# EasyEDA Pro project 四轮车板子.epro, schematic Schematic2

## Sheets
1 Power: Create Date: 2023-06-30; Page Name: Power; Project Name: 国光_无敌车; Schematic Name: Schematic2; Update Date: 2023-06-30; Add into BOM: yes; Convert to PCB: yes
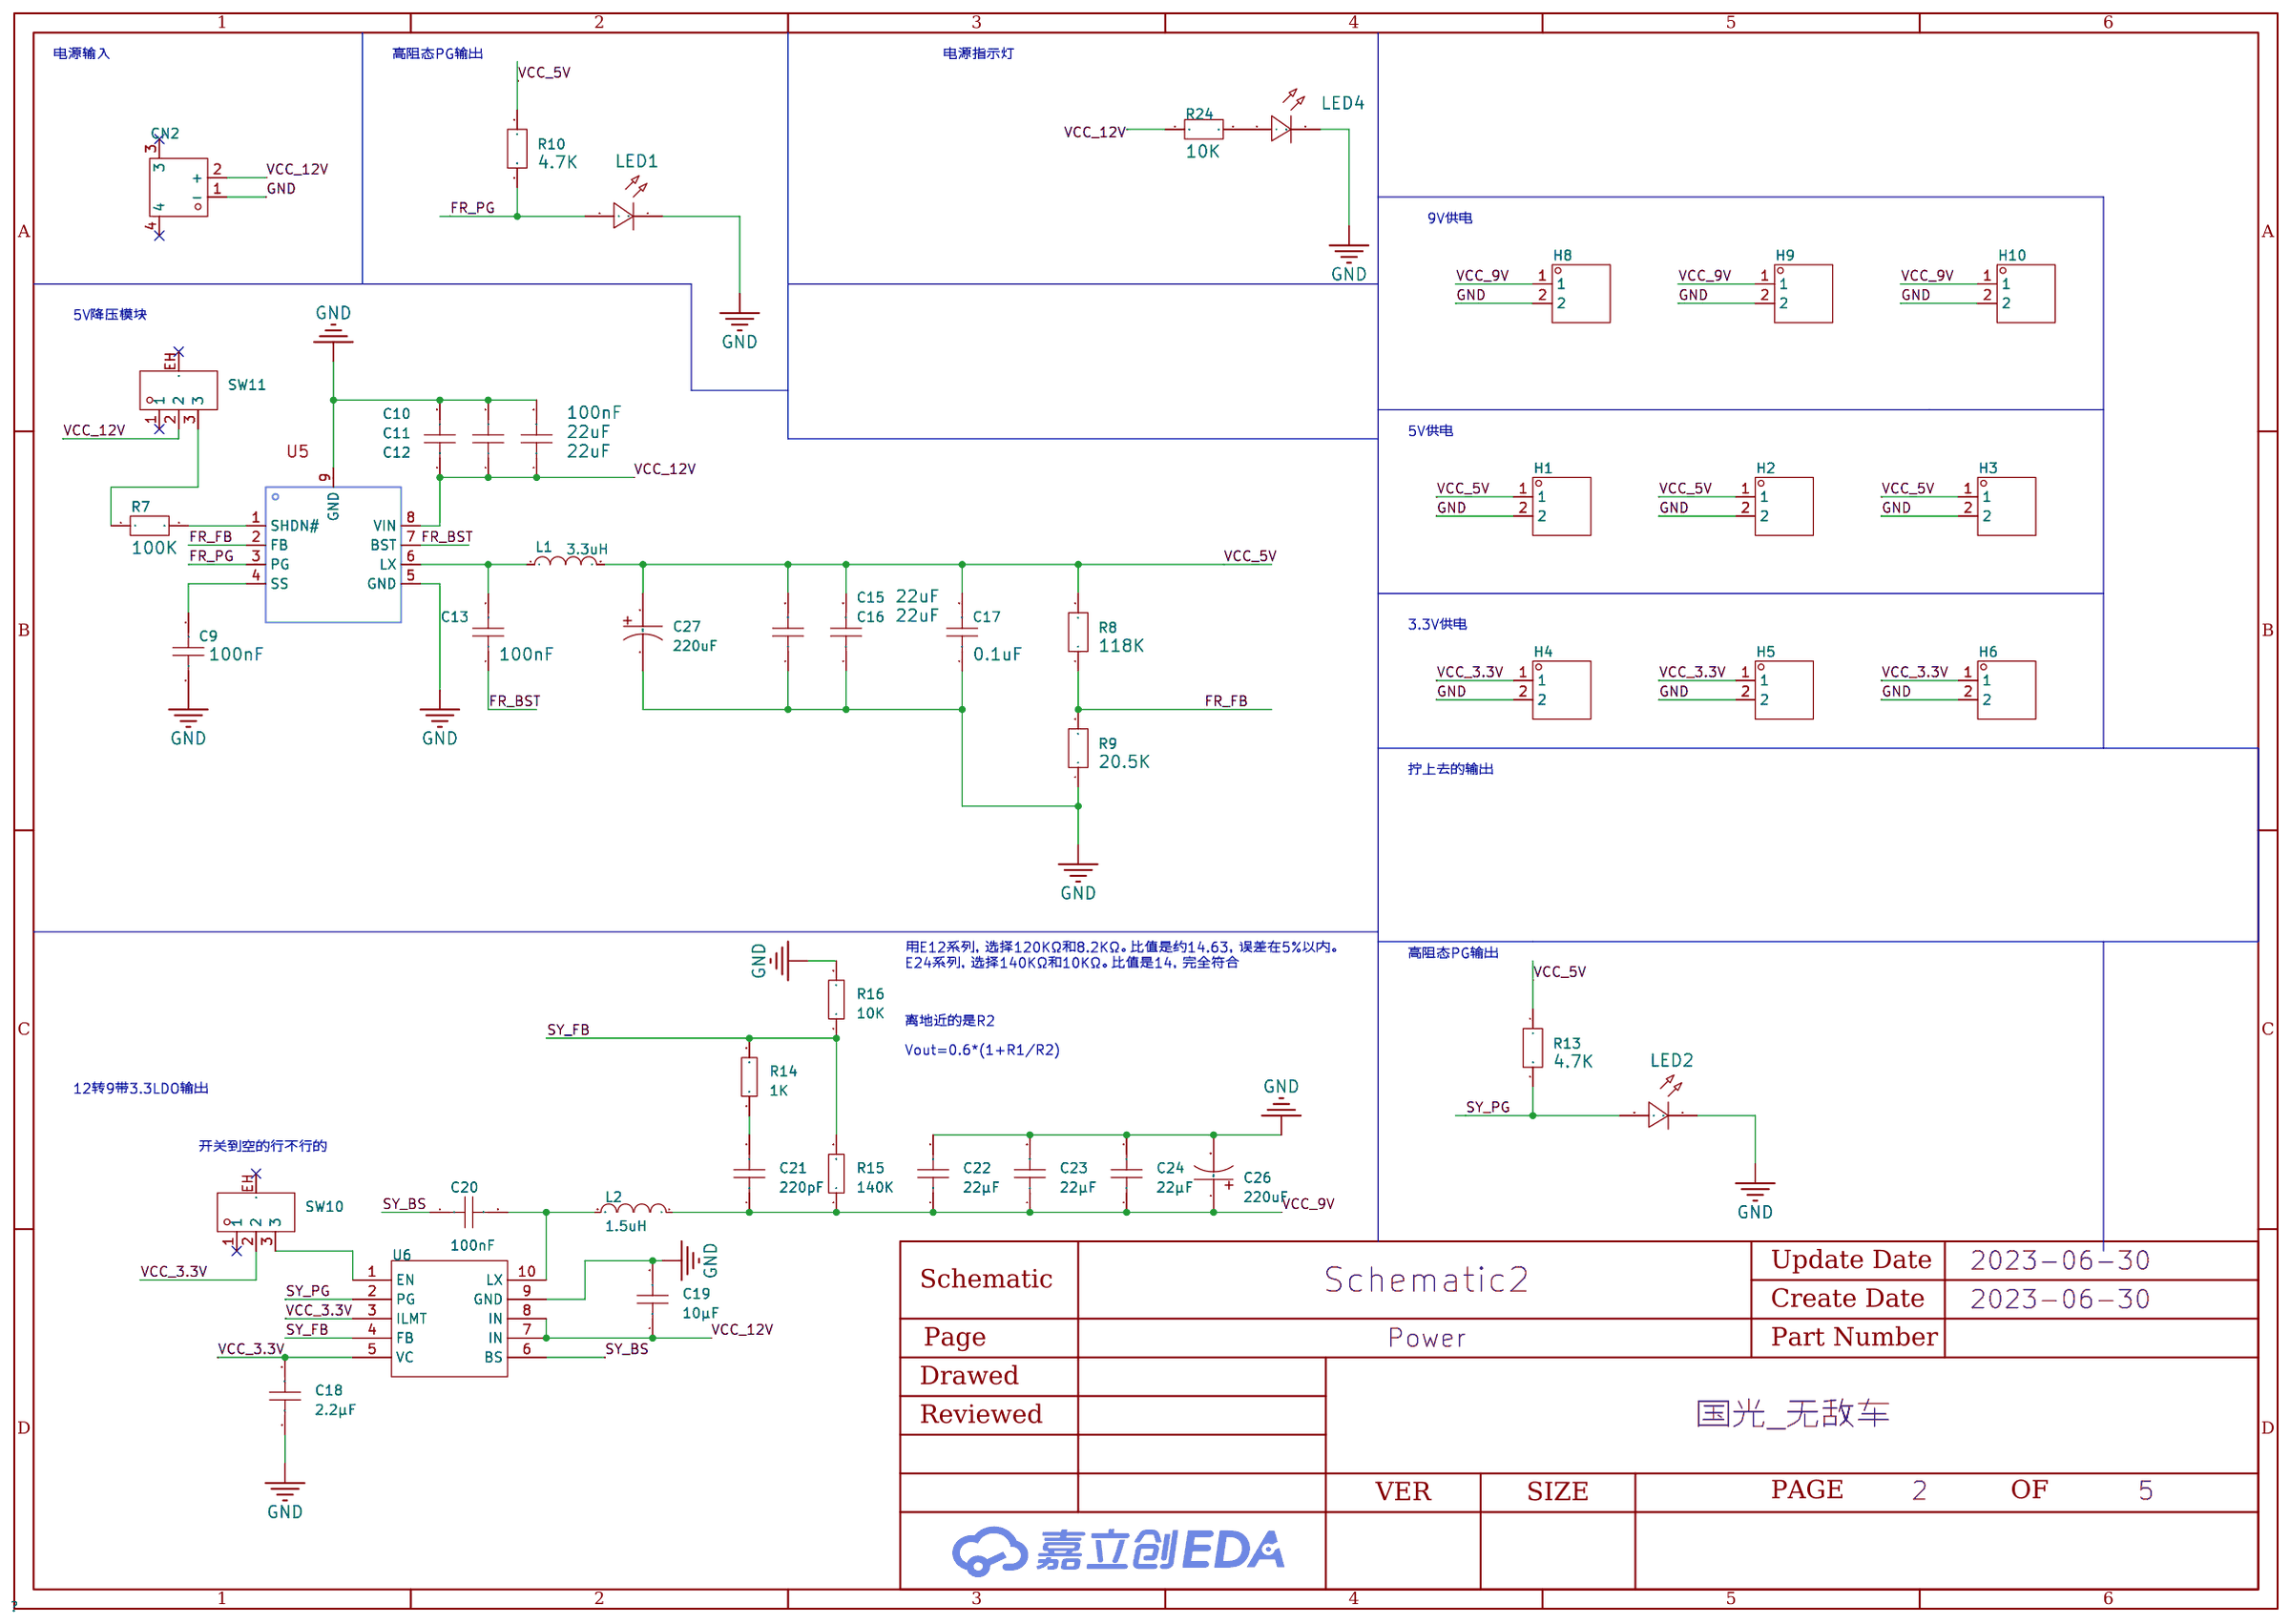
[diagram p6: Power]
2 raspberry: Page Name: raspberry; Update Date: 2023-07-02; Company: 嘉立创EDA; Page Size: A4; Version: V1.0
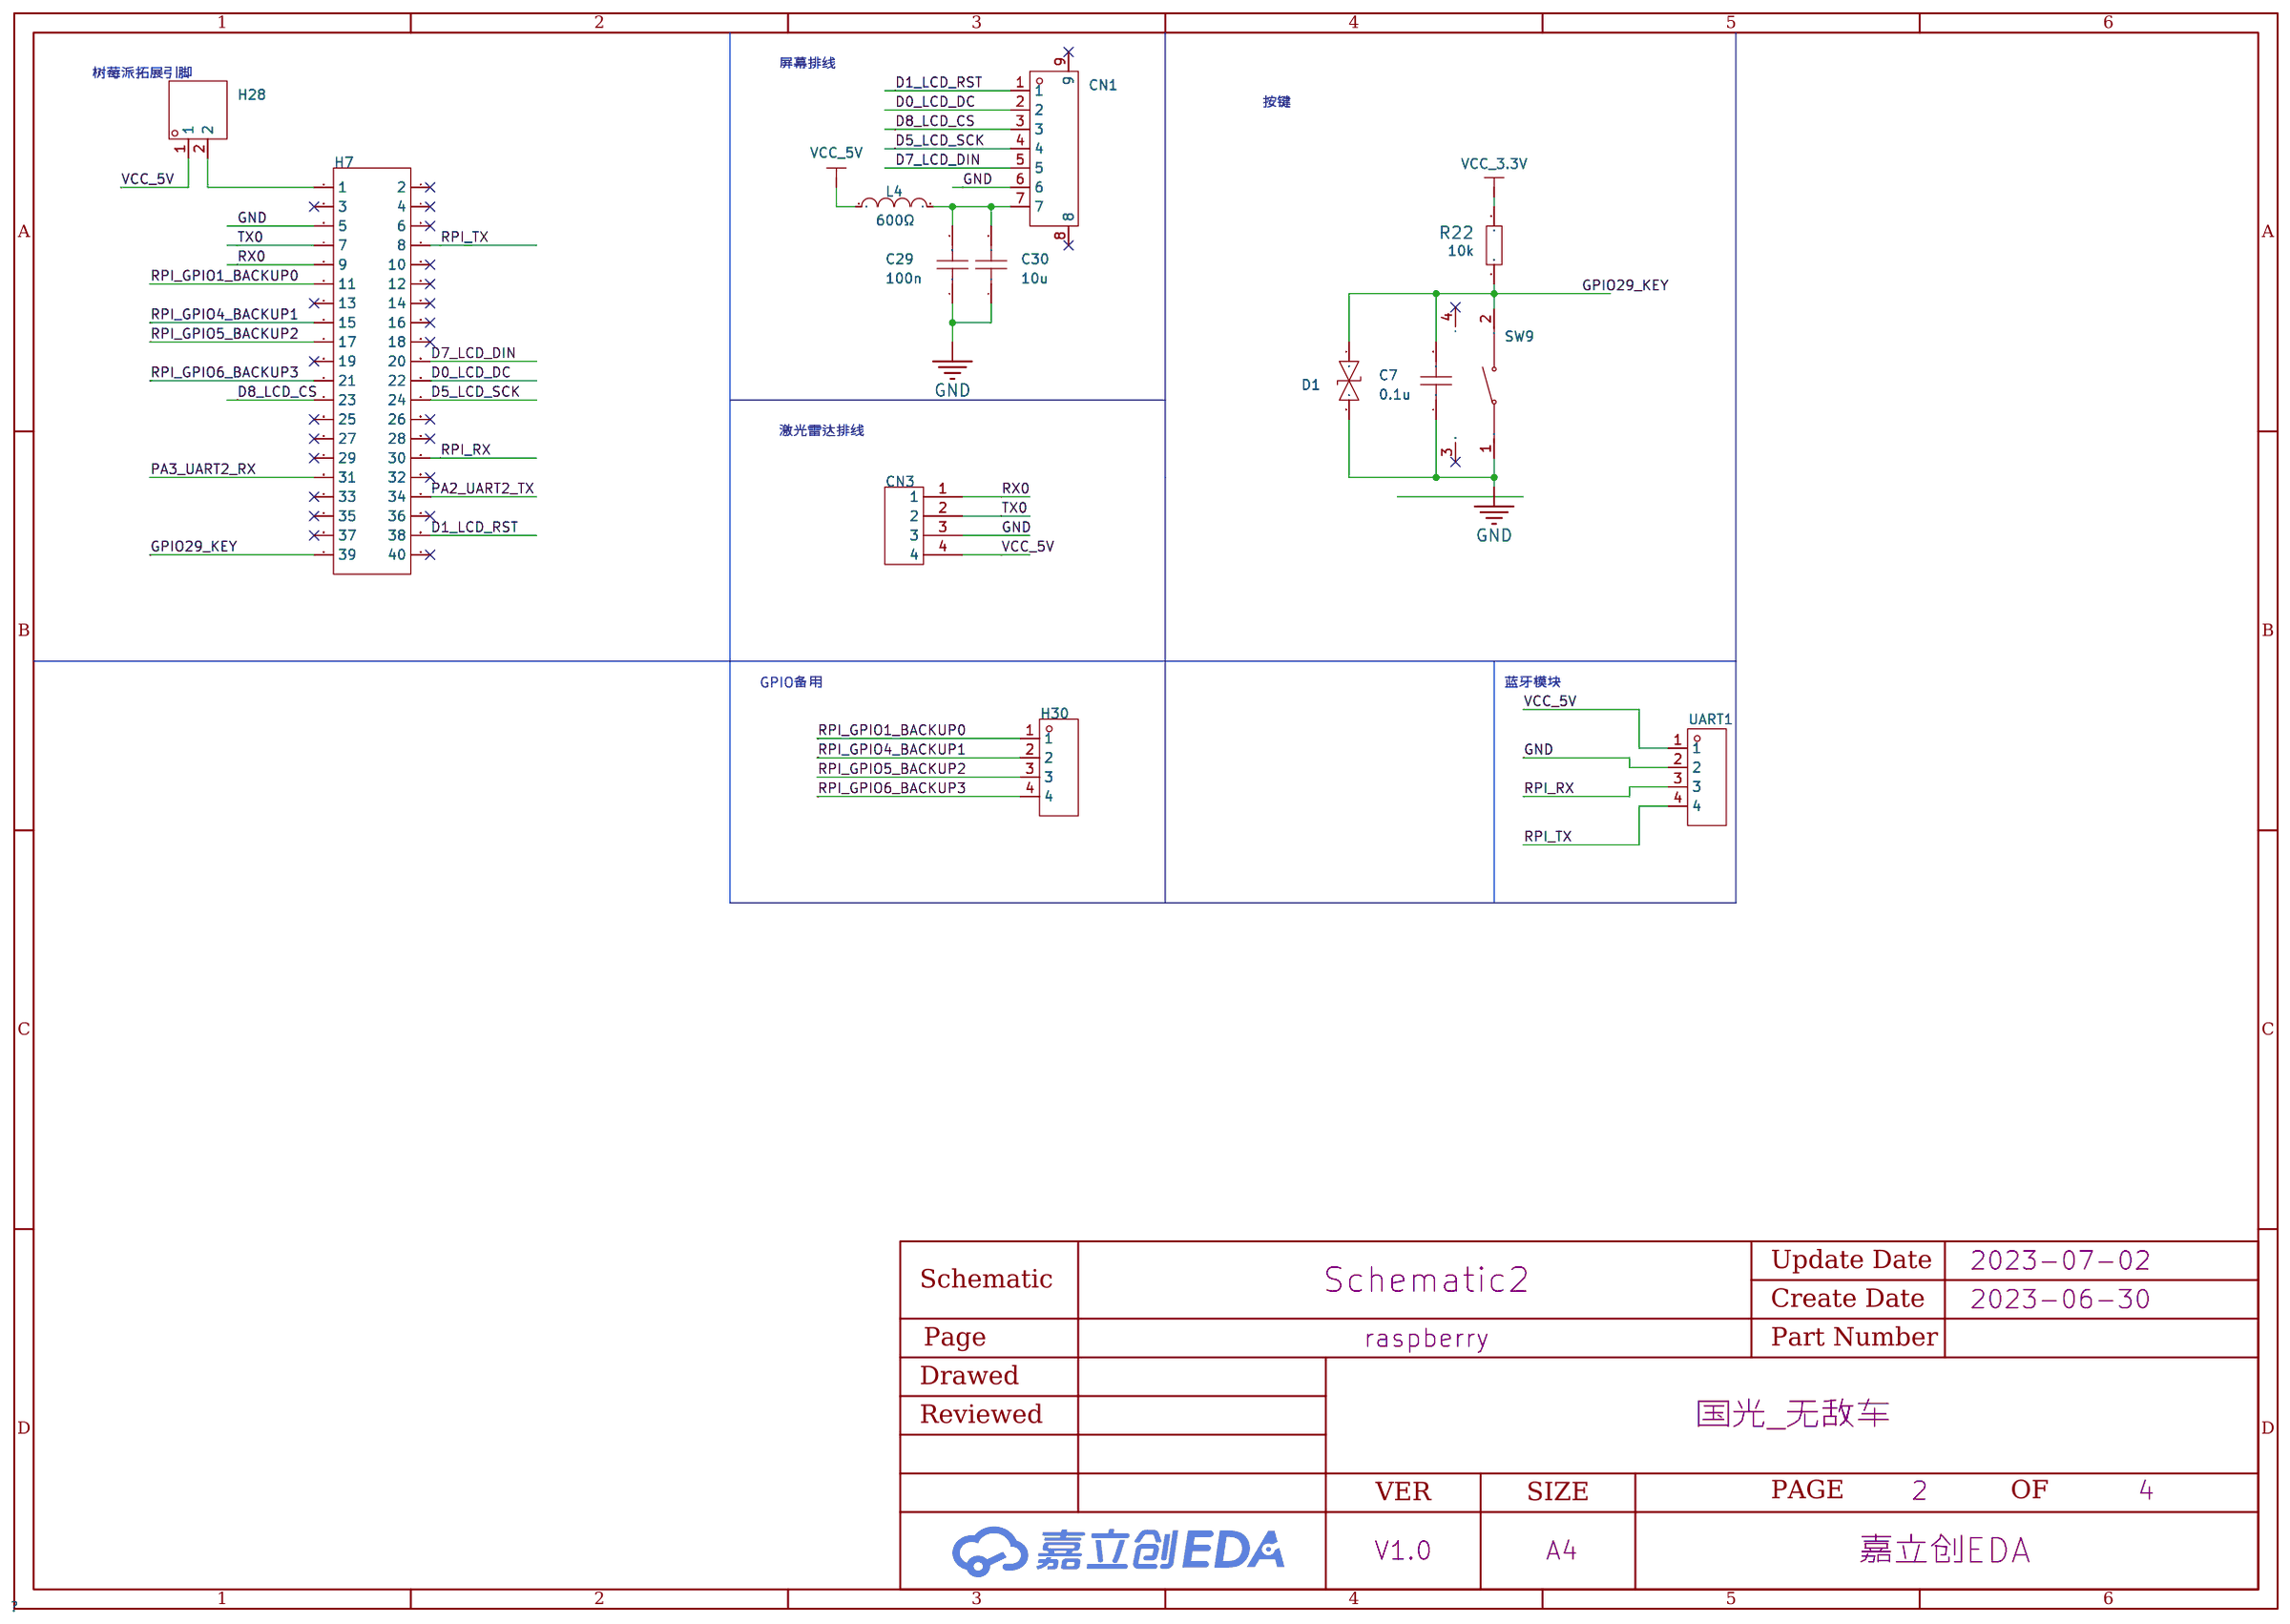
[diagram p7: raspberry]
3 harddrive: Page Name: harddrive; Update Date: 2023-07-02; Company: 嘉立创EDA; Page Size: A4; Version: V1.0
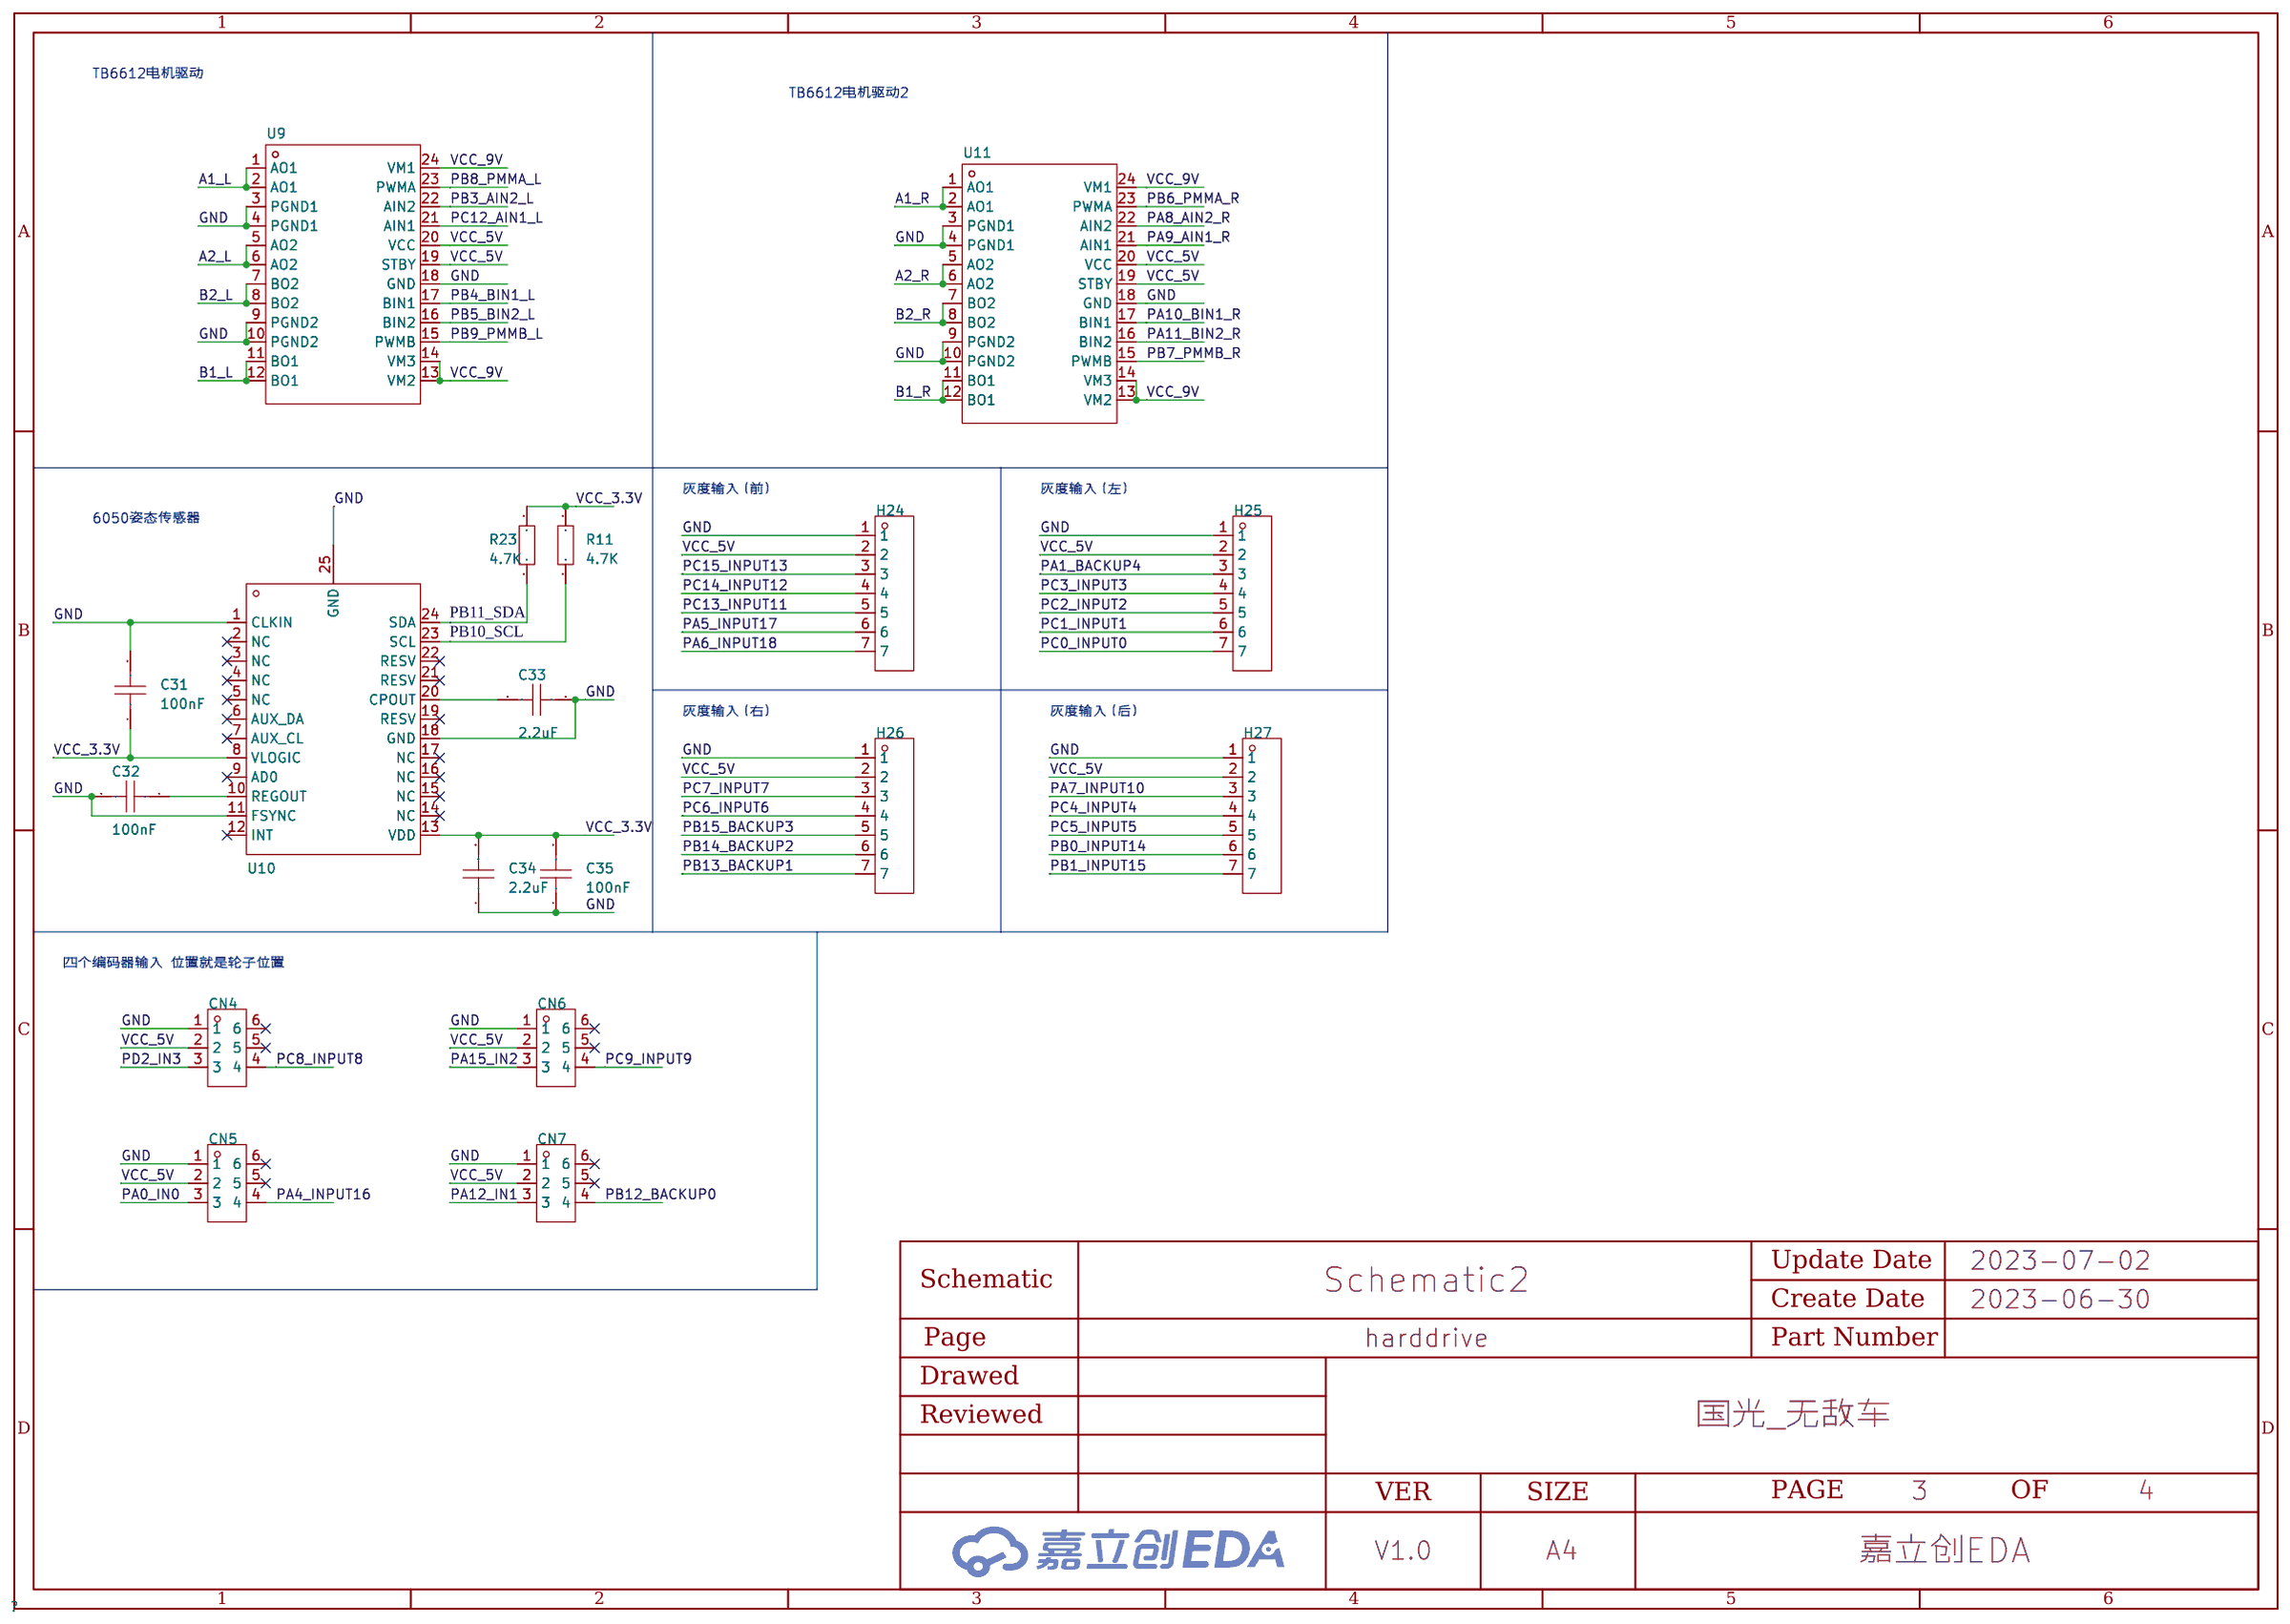
[diagram p8: harddrive]
4 RCT6: Create Date: 2023-07-02; Page Name: RCT6; Update Date: 2023-07-02; Company: 嘉立创EDA; Page Size: A4; Version: V1.0
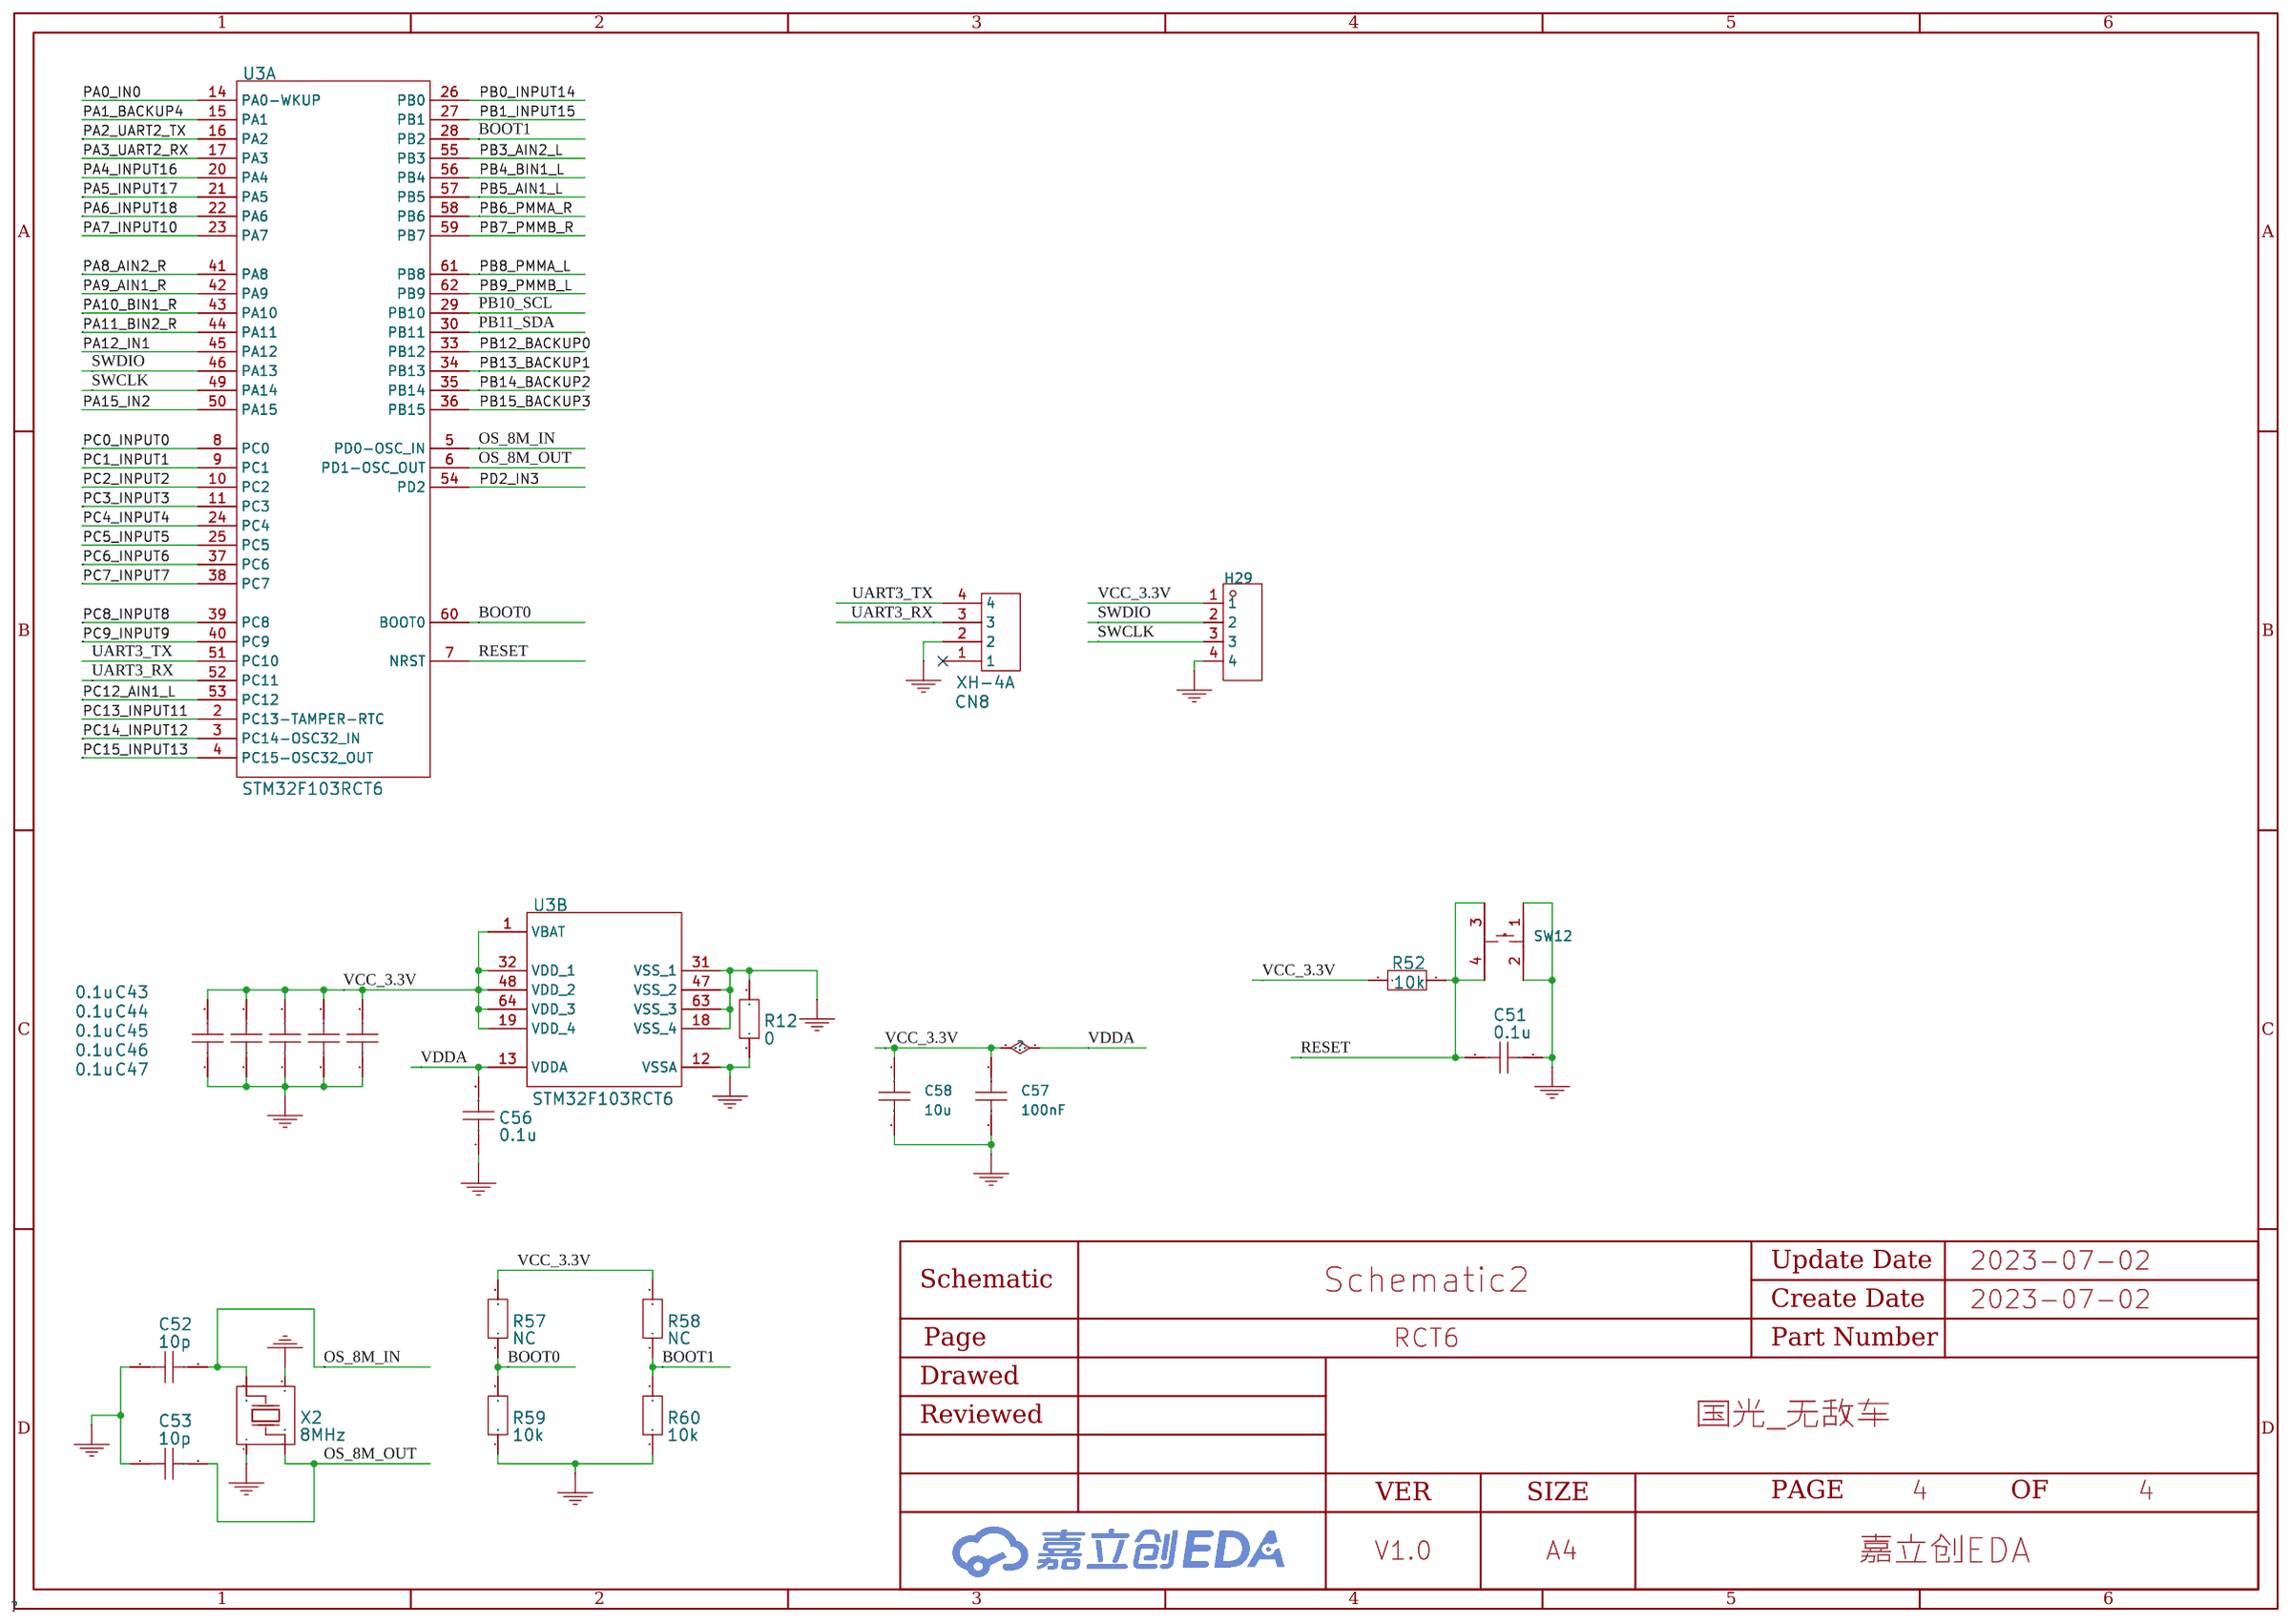
[diagram p9: RCT6]

## Parts
sheet harddrive
C31  100nF  [C0603]
C32  100nF  [C0603]
C33  2.2uF  [C0603]
C34  2.2uF  [C0603]
C35  100nF  [C0603]
CN4  BH254V-6P  [IDC-TH_6P-P2.54-V-R2-C3-S2.54]
CN5  BH254V-6P  [IDC-TH_6P-P2.54-V-R2-C3-S2.54]
CN6  BH254V-6P  [IDC-TH_6P-P2.54-V-R2-C3-S2.54]
CN7  BH254V-6P  [IDC-TH_6P-P2.54-V-R2-C3-S2.54]
H24  -  [HDR-TH_7P-P2.54-V-M]
H25  -  [HDR-TH_7P-P2.54-V-M]
H26  -  [HDR-TH_7P-P2.54-V-M]
H27  -  [HDR-TH_7P-P2.54-V-M]
R11  4.7K  [R0603]
R23  4.7K  [R0603]
U9  TB6612FNG,C,8,EL  [SSOP-24_L8.3-W5.6-P0.65-LS7.6-BL]
U10  MPU-6050  [QFN-24_L4.0-W4.0-P0.50-BL-EP2.7]
U11  TB6612FNG,C,8,EL  [SSOP-24_L8.3-W5.6-P0.65-LS7.6-BL]
sheet Power
C9  100nF  [C0603]
C10  22uF  [C0603]
C11  22uF  [C0603]
C12  100nF  [C0603]
C13  100nF  [C0603]
C15  22uF  [C0603]
C16  22uF  [C0603]
C17  0.1uF  [C0603]
C18  2.2μF  [C0603]
C19  10μF  [C0603]
C20  100nF  [C0603]
C21  220pF  [C0603]
C22  22μF  [C0603]
C23  22μF  [C0603]
C24  22μF  [C0603]
C26  220uF  [CAP-TH_BD8.0-P3.50-D0.6-FD]
C27  220uF  [CAP-TH_BD8.0-P3.50-D0.6-FD]
CN2  XT60PW-M  [CONN-TH_XT60PW-M]
H1  -  [HDR-TH_2P-P2.54-V-M-1]
H2  -  [HDR-TH_2P-P2.54-V-M-1]
H3  -  [HDR-TH_2P-P2.54-V-M-1]
H4  -  [HDR-TH_2P-P2.54-V-M-1]
H5  -  [HDR-TH_2P-P2.54-V-M-1]
H6  -  [HDR-TH_2P-P2.54-V-M-1]
H8  -  [HDR-TH_2P-P2.54-V-M-1]
H9  -  [HDR-TH_2P-P2.54-V-M-1]
H10  -  [HDR-TH_2P-P2.54-V-M-1]
L1  3.3uH  [IND-SMD_L7.0-W6.6]
L2  1.5uH  [IND-SMD_L13.2-W12.9]
LED1  -  [LED_0603]
LED2  -  [LED_0603]
LED4  -  [LED_0603]
R7  100K  [R0603]
R8  118K  [R0603]
R9  20.5K  [R0603]
R10  4.7K  [R0603]
R13  4.7K  [R0603]
R14  1K  [R0603]
R15  140K  [R0603]
R16  10K  [R0603]
R24  10K  [R0603]
SW10  SS12D07L3B  [SW-TH_SS-12D07-X-X]
SW11  SS12D07L3B  [SW-TH_SS-12D07-X-X]
U5  FR9855SP  [SOIC-8_L4.9-W3.9-P1.27-LS6.0-BL-EP3.3]
U6  SY8368QNC  [QFN-10_L3.0-W3.0-P0.45-TL_SILERGY]
sheet raspberry
C7  0.1u  [C0603]
C29  100n  [C0603]
C30  10u  [C0603]
CN1  X8821WRS-07-9TSN  [CONN-SMD_X8821WRS-07-9TSN]
CN3  XH-4A  [CONN-TH_4P-P2.50_XH-4A]
D1  SD03C  [SOD-323_L1.8-W1.3-LS2.5-BI]
H7  2.54mm2*20P直排针  [HDR-TH_40P-P2.54-V-M-R2-C20-S2.54]
H28  -  [HDR-TH_2P-P2.54-V-M-1]
H30  -  [HDR-TH_4P-P2.54-V-M]
L4  600Ω  [L0603]
R22  10k  [R0603]
SW9  KAN0637-0701B  [SW-TH_KAN0637-0701B]
UART1  -  [HDR-TH_4P-P2.54-V-F]
sheet RCT6
C43  0.1u  [C0603]
C44  0.1u  [C0603]
C45  0.1u  [C0603]
C46  0.1u  [C0603]
C47  0.1u  [C0603]
C51  0.1u  [C0603]
C52  10p  [C0603]
C53  10p  [C0603]
C56  0.1u  [C0603]
C57  100nF  [C0603]
C58  10u  [C0603]
CN8  XH-4A  [CONN-TH_4P-P2.50_XH-4A]
H29  -  [HDR-TH_4P-P2.54-V-M]
R12  0  [R0603]
R52  10k  [R0603]
R57  NC  [R0603]
R58  NC  [R0603]
R59  10k  [R0603]
R60  10k  [R0603]
SW12  -  [SW-SMD_4P-L4.2-W3.4-P2.15-LS4.5-TL]
U3  STM32F103RCT6  [LQFP-64_L10.0-W10.0-P0.50-LS12.0-BL]  (sections 1,2)
X2  8MHz  [OSC-SMD_4P-L3.2-W2.5-BL]

## Library data of the parts
C7 C18-C24 C29-C35 C57 C58 = CAP_0603: Supplier Footprint: 0603
CN4-CN7 = BH254V-6P: 连接器类型:简牛座;每排PIN数:3;排数:2;间距:2.54mm;行距:2.54mm;封装形式:直插;额定电流:3A;额定电压:250V;工作温度范围:-40℃~+105℃;; LCSC Part Name: 每排P数:3 排数:2 2.54mm; Supplier Part: C492441; Manufacturer: XFCN(兴飞); Supplier Footprint: 插件,P=2.54mm; JLCPCB Part Class: Extended Part; Datasheet: https://atta.szlcsc.com/upload/public/pdf/source/20200312/C492441_A0C73C694DE4BA8B104DAD845E0E2036.pdf; Supplier: LCSC; Connector Type: 简牛座; Pin Number in each Row: 3; Number of Rows: 2; Pitch: 2.54mm; Row Spacing: 2.54mm; Holder Type: 直插; Current Rating (Max): 3A; Voltage Rating (Max): 250V; Operating Temperature Range: -40℃~+105℃
H24-H27 = HDR-M_2.54_1x7P: Supplier Part: C492406; Supplier Footprint: 插件
R11 R14-R16 R23 = Res_0603: Supplier Footprint: 0603
U9 U11 = TB6612FNG,C,8,EL: 类型:有刷直流电机;电源电压:2.7V~5.5V;输出电流:1A;接口:并行;; Supplier Part: C141517; Manufacturer: TOSHIBA(东芝); Supplier Footprint: SSOP-24; JLCPCB Part Class: ExtendedPart; Datasheet: https://atta.szlcsc.com/upload/public/pdf/source/20171128/C141517_15118625624231147036.pdf; Supplier: LCSC; Type: 有刷直流电机; Supply Voltage: 2.7V~5.5V; Output Current: 1A; Interface: 并行; Operating Temperature: -20℃~+85℃@(Ta)
U10 = MPU-6050: 三轴加速度计和三轴陀螺仪，工作电压：2.375V~3.46V; Supplier Part: C24112; Manufacturer: TDKInvenSense(应美盛); Supplier Footprint: QFN-24(4x4); JLCPCB Part Class: BasicPart; Datasheet: https://atta.szlcsc.com/upload/public/pdf/source/20140425/1457707046159.pdf; Supplier: LCSC
C9-C13 C15-C17 = 0603: Supplier Part: C9900021180; JLCPCB Part Class: ExtendedPart; Datasheet: https://atta.szlcsc.comnull; Supplier: LCSC
C26 C27 = SPZ1EM221F11O00RAXXX: 类型:-;容值:220uF;精度:±20%;额定电压:25V;纹波电流:2.55A@100kHz;等效串联电阻:20mΩ@100kHz;; LCSC Part Name: 220uF±20%25V; Supplier Part: C160181; Manufacturer: AISHI(艾华集团); Supplier Footprint: 插件,8x11mm; JLCPCB Part Class: 扩展库; Datasheet: https://atta.szlcsc.com/upload/public/pdf/source/20180906/C160181_A9A2ACDA3CC278FCDBAF747E681A6DA5.pdf; Supplier: LCSC; Tolerance: ±20%; Rated Voltage: 25V; φD: 8mm; L: 11mm; Lead Spacing: 3.5mm; Ripple Current: 2.55A@100kHz; Equivalent Series Resistance(ESR): 20mΩ@100kHz; Lifetime @ Temp: 2000hrs@105℃; Operating Temperature: -55℃~+105℃
CN2 = XT60PW-M: 模型锂电连接器; LCSC Part Name: AMASS(艾迈斯)航模插头xt90连接器150公母对接pw锂电池公头 板插卧式XT60PW-M; Supplier Part: C98732; Manufacturer: AMASS(艾迈斯); JLCPCB Part Class: 扩展库; Datasheet: https://atta.szlcsc.com/upload/public/pdf/source/20180125/C98732_15168617837851301983.pdf; Supplier: LCSC
H1-H6 H8-H10 H28 = HDR-M_2.54_1x2P: Supplier Part: C124375; Supplier Footprint: 插件
L1 = MDE0630-3R3M: 电感值:3.3uH;精度:±20%;额定电流:8.5A;直流电阻(DCR):22mΩ;; LCSC Part Name: 3.3uH±20%8.5A22mΩ; Supplier Part: C842910; Manufacturer: KOHERelec(科或); Supplier Footprint: SMD; JLCPCB Part Class: ExtendedPart; Datasheet: https://atta.szlcsc.com/upload/public/pdf/source/20201020/C842876_921BC143FC4038D46DEA50C28FA6C954.pdf; Supplier: LCSC; Tolerance: ±20%; Rated Current: 8.5A; DC Resistance (DCR): 22mΩ
L2 = SLB1365P2R2MTT: 电感值:2.2uH;精度:±20%;额定电流:-;; LCSC Part Name: 2.2uH±20%4mΩ; Supplier Part: C397798; Manufacturer: Sunltech(韩国顺磁); Supplier Footprint: SMD; JLCPCB Part Class: ExtendedPart; Datasheet: https://atta.szlcsc.com/upload/public/pdf/source/20190709/C397798_DB90DB1ECAD754E8E5BE4E3332B468E1.pdf; Supplier: LCSC; Tolerance: ±20%; DC Resistance (DCR): 4mΩ
LED1 LED2 LED4 = LED_0603-R: Supplier Footprint: 0603
R7-R10 R13 R24 = 0603: Supplier Part: C9900021178; JLCPCB Part Class: ExtendedPart; Datasheet: https://atta.szlcsc.comnull; Supplier: LCSC
SW10 SW11 = SS12D07L3B: 额定电流(DC):300mA;额定电压(DC):50V;额定电流(AC):300mA;额定电压(AC):50V;电路结构:单刀双掷;安装方式:直插;机械寿命:1万次;开关颜色:白色;; LCSC Part Name: 柄长3mm直插双档滑动开关可过回流焊抗腐蚀24小时; Supplier Part: C480343; Manufacturer: XKBConnectivity(中国星坤); Supplier Footprint: 插件; JLCPCB Part Class: ExtendedPart; Datasheet: https://atta.szlcsc.com/upload/public/pdf/source/20211011/A4A3AD0F33A9C1BFA54473754C5756AE.pdf; Supplier: LCSC; Current Rating (DC): 300mA; Voltage Rating (DC): 50V; Current Rating (AC): 300mA; Voltage Rating (AC): 50V; Circuit: 单刀双掷; Mounting Style: 直插; Mechanical Life: 1万次; Actuator Color: 白色; Actuator Style: 矩形柱状; Pin Style: PC引脚; Operating Temperature: -40℃~+85℃; Switch Length: 8.6mm; Switch Width: 4.5mm; Switch Height: 4.7mm
U5 = FR9855SP: Supplier: LCSC; Supplier Part: C389169; Manufacturer: FitipowerIntegratedTech; JLCPCB Part Class: ExtendedPart
U6 = SY8368QNC: 功能类型:降压型;同步整流:-;输出通道数:-;拓扑结构:-;输入电压:-;输出电流(最大值):-;开关频率:-;; LCSC Part Name: 降压型; Supplier Part: C125897; Manufacturer: silergy(矽力杰); Supplier Footprint: QFN-10; JLCPCB Part Class: ExtendedPart; Datasheet: https://atta.szlcsc.com/upload/public/pdf/source/20170810/C125897_1502335373345879955.pdf; Supplier: LCSC; Function: 降压型
CN1 = X8821WRS-07-9TSN: 参考系列:-;间距:2.5mm;插针结构:1x7P;排数:1;每排PIN数:7;行距:-;公母:公型插针;安装方式:卧贴;额定电流:3A;触头材质:黄铜;触头镀层:锡;工作温度范围:-25℃~+85℃;焊接温度(最大值):260℃;; LCSC Part Name: 2.5mm1x7P卧贴; Supplier Part: C519020; Manufacturer: XKBConnectivity(中国星坤); Supplier Footprint: SMD,P=2.5mm; JLCPCB Part Class: ExtendedPart; Datasheet: https://atta.szlcsc.com/upload/public/pdf/source/20211009/147B79B22FE81B32D021ABC3AE751292.pdf; Supplier: LCSC; Pitch: 2.5mm; Pins Structure: 1x7P; Number of Rows: 1; Number of PINs Per Row: 7; Gender: 公型插针; Mounting Style: 卧贴; Current Rating (Max): 3A; Contact Material: 黄铜; Contact Plating: 锡; Operating Temperature Range: -25℃~+85℃; Welding Temperature (Max): 260℃
CN3 = XH-4A_C37815: 参考系列:XH;间距:2.5mm;插针结构:1x4P;排数:1;每排PIN数:4;行距:-;安装方式:-;触头材质:磷青铜;; LCSC Part Name: XH2.5mm1x4P; Supplier Part: C37815; Manufacturer: BOOMELE(博穆精密); Supplier Footprint: 插件,P=2.5mm; JLCPCB Part Class: ExtendedPart; Datasheet: https://atta.szlcsc.com/upload/public/pdf/source/20170919/C37815_1505787307039977083.pdf; Supplier: LCSC; Reference Series: XH; Pitch: 2.5mm; Pins Structure: 1x4P; Number of Rows: 1; Number of PINs Per Row: 4; Contact Material: 磷青铜
D1 = SD03C_C502532: 极性:双向;反向截止电压(Vrwm):3.3V;击穿电压(最小值):4V;峰值脉冲电流(Ipp)@10/1000μs:20A;最大钳位电压:16V;; LCSC Part Name: 双向3.3V; Supplier Part: C502532; Manufacturer: MDD; Supplier Footprint: SOD-323; JLCPCB Part Class: ExtendedPart; Datasheet: https://atta.szlcsc.com/upload/public/pdf/source/20200324/C502532_7D4F0BBE100E5AA5810517A79C4A6636.pdf; Supplier: LCSC; Polarity: 双向; Reverse Stand-Off Voltage (Vrwm): 3.3V; Breakdown Voltage (Min): 4V; Peak Pulse Current (Ipp)@10/1000μs: 20A; Maximum Clamping Voltage: 16V
H7 = 2.54mm 2*20P直排针: 排数:双排;总PIN位数:40;间距:2.54mm;插针结构:2x20P;行距:2.54mm;安装类型:直插;圆针/方针:方针;额定电流:3A;额定电压:-;配合针长度:6mm;塑高:-;端接针长度:3mm;触头材质:黄铜;触头镀层:-;工作温度范围:-40℃~+105℃;颜色:黑色;; LCSC Part Name: 2.54mm2x20P直插方针; Supplier Part: C50980; Manufacturer: BOOMELE(博穆精密); Supplier Footprint: 直插,P=2.54mm; JLCPCB Part Class: ExtendedPart; Datasheet: https://atta.szlcsc.com/upload/public/pdf/source/20151109/1457707571465.pdf; Supplier: LCSC; Number of Rows: 双排; Number of Pins: 40; Pitch: 2.54mm; Pin Structure: 2x20P; Row Spacing: 2.54mm; Mounting Type: 直插; Circluar Pins/Square Pins: 方针; Current Rating (Max): 3A; Length of Mating Pin: 6mm; Length of End Connection Pin: 3mm; Contact Material: 黄铜; Operating Temperature Range: -40℃~+105℃; Color: 黑色
H29 H30 = HDR-M_2.54_1x4P: Supplier Part: C492403; Supplier Footprint: 插件
L4 = L_0603
R22 = AECR0603F1K50K9: 电阻类型:厚膜电阻;阻值:1.5kΩ;精度:±1%;功率:100mW;温度系数:±100ppm/℃;最大工作电压:50V;工作温度范围:-55℃~+125℃;; LCSC Part Name: 1.5kΩ±1%100mW; Supplier Part: C328342; Manufacturer: RESI(开步睿思）; Supplier Footprint: 0603; JLCPCB Part Class: ExtendedPart; Datasheet: https://atta.szlcsc.com/upload/public/pdf/source/20181108/C328342_08016E9BF35BA46A3CF0C17D76B66363.pdf; Supplier: LCSC; Type: 厚膜电阻; Tolerance: ±1%; Power(Watts): 100mW; Temperature Coefficient: ±100ppm/℃; Overload Voltage (Max): 50V; Operating Temperature Range: -55℃~+125℃
SW9 = KAN0637-0701B: 触点电流:50mA;额定电压(DC):12V;电路结构:单刀单掷;按钮作用方向:侧面触动;致动器样式:圆形按钮;照明颜色:-;; LCSC Part Name: KAN0637-0701B,带支架侧插; Supplier Part: C231668; Manufacturer: GANGYUAN(港源); Supplier Footprint: 插件; JLCPCB Part Class: ExtendedPart; Datasheet: https://atta.szlcsc.com/upload/public/pdf/source/20190514/C231668_6047F7280E58C7CF3EE5207263CCBB46.pdf; Supplier: LCSC; Contact Current: 50mA; Voltage Rating (DC): 12V; Circuit: 单刀单掷; Actuator Orientation: 侧面触动; Actuator Style: 圆形按钮
UART1 = HDR-F_2.54_1x4P: Supplier Part: C2718488; Supplier Footprint: 插件
C43-C47 C51 C56 = 0.1u: link: https://item.szlcsc.com/15869.html; 3DModel: C0402_L1.0-W0.5-H0.5
C52 C53 = 10p: link: https://item.szlcsc.com/15869.html; 3DModel: C0402_L1.0-W0.5-H0.5
CN8 = XH-4A: link: https://atta.szlcsc.com/upload/public/pdf/source/20170919/C37815_1505787307039977083.pdf; Supplier: LCSC; Manufacturer: BOOMELE; Supplier Part: C37815; JLCPCB Part Class: ExtendedPart
R12 = 0: 3DModel: R0603_L1.6-W0.8-H0.8; link: https://www.mouser.in/datasheet/2/447/PYu_RT_1_to_0_01_RoHS_L_11-1669912.pdf
R52 R59 R60 = 10k: link: https://item.szlcsc.com/323315.html; 3DModel: R0402_L1.0-W0.5-H0.5
R57 R58 = NC: link: https://item.szlcsc.com/323315.html; 3DModel: R0402_L1.0-W0.5-H0.5
SW12 = YTSA016A0252501B: 触点电流:50mA;额定电压(DC):12V;绝缘电阻:100MΩ;电路结构:单刀单掷;安装方式:立贴;按钮形状:椭圆形按钮;按钮/盖帽颜色:白色;作用力:250gf;机械寿命:100000;引脚样式:J型引脚;开关长度:4.2mm;开关宽度:3.4mm;开关高度:2.5mm;带支架:否;; LCSC Part Name: 4.2*3.*2.5H-J250gf白钮翘脚编带; Supplier Part: C967791; Manufacturer: DGBZ(东莞博众); Supplier Footprint: SMD; JLCPCB Part Class: ExtendedPart; Datasheet: https://atta.szlcsc.com/upload/public/pdf/source/20201210/C967791_DCF099188004B981ADA3DDF2841F8914.pdf; Supplier: LCSC; Contact Current: 50mA; Voltage Rating (DC): 12V; Insulation Resistance: 100MΩ; Circuit: 单刀单掷; Mounting Style: 立贴; Actuator Style: 椭圆形按钮; Actuator/Cap Color: 白色; Operating Force: 250gf; Mechanical Life: 100000; Pin Style: J型引脚; Switch Length: 4.2mm; Switch Width: 3.4mm; Switch Height: 2.5mm; Strike Gundam: 否
U3 = STM32F103RCT6: link: https://item.szlcsc.com/92458.html; 3DModel: LQFP-64_L10.0-W10.0-H1.4-LS12.0-P0.50; Supplier: LCSC; Manufacturer: STMicroelectronics; image: //image.lceda.cn/szlcsc/C8323.jpg; Supplier Part: C8323; JLCPCB Part Class: ExtendedPart
X2 = 8MHz: link: https://item.szlcsc.com/15866.html; 3DModel: OSC-SMD_4P-L3.2-W2.5-H1.0; Supplier: LCSC; Supplier Part: C400090; Manufacturer: ZhejiangAbelElec; Manufacturer Part: TAXM8M4RDBCCT2T; JLCPCB Part Class: ExtendedPart

## Nets
AGND: C56.1 R12.1 U3.12(VSSA)
GND: C7.1 C9.1 C10.2 C11.2 C12.2 C15.1 C16.1 C17.1 C18.1 C19.2 C22.2 C23.2 C24.2 C26.2 C27.2 C29.1 C30.1 C31.2 C32.2 C33.2 C34.1 C35.1 C43.1 C44.1 C45.1 C46.1 C47.1 C51.2 C52.1 C53.1 C57.2 C58.2 CN1.6 CN2.1(-) CN3.3 CN4.1 CN5.1 CN6.1 CN7.1 CN8.2 D1.2 H1.2 H2.2 H3.2 H4.2 H5.2 H6.2 H7.5 H8.2 H9.2 H10.2 H24.1 H25.1 H26.1 H27.1 H29.4 LED1.1(C) LED2.1(C) LED4.1(C) R9.1 R12.2 R16.2 R59.1 R60.1 SW9.1 SW12.1 SW12.2 U3.18(VSS_4) U3.31(VSS_1) U3.47(VSS_2) U3.63(VSS_3) U5.5(GND) U5.9(GND) U6.9(GND) U9.3(PGND1) U9.4(PGND1) U9.9(PGND2) U9.10(PGND2) U9.18(GND) U10.1(CLKIN) U10.11(FSYNC) U10.18(GND) U10.25(GND) U11.3(PGND1) U11.4(PGND1) U11.9(PGND2) U11.10(PGND2) U11.18(GND) UART1.2 X2.2 X2.4
VCC_3.3V: C18.2 C31.1 C34.2 C35.2 C43.2 C44.2 C45.2 C46.2 C47.2 C56.2 C57.1 C58.1 H4.1 H5.1 H6.1 H29.1 R11.2 R22.2 R23.2 R52.1 R57.2 R58.2 SW10.2 U3.1(VBAT) U3.13(VDDA) U3.19(VDD_4) U3.32(VDD_1) U3.48(VDD_2) U3.64(VDD_3) U6.3(ILMT) U6.5(VC) U10.8(VLOGIC) U10.13(VDD)
VCC_5V: C15.2 C16.2 C17.2 C27.1 CN3.4 CN4.2 CN5.2 CN6.2 CN7.2 H1.1 H2.1 H3.1 H24.2 H25.2 H26.2 H27.2 H28.1 L1.2 L4.1 R8.2 R10.1 R13.1 U9.19(STBY) U9.20(VCC) U11.19(STBY) U11.20(VCC) UART1.1
VCC_9V: C21.1 C22.1 C23.1 C24.1 C26.1 H8.1 H9.1 H10.1 L2.1 R15.1 U9.13(VM2) U9.14(VM3) U9.24(VM1) U11.13(VM2) U11.14(VM3) U11.24(VM1)
VCC_12V: C10.1 C11.1 C12.1 C19.1 CN2.2(+) R24.1 SW11.2 U5.8(VIN) U6.7(IN) U6.8(IN)
A1_L: U9.1(AO1) U9.2(AO1)
A1_R: U11.1(AO1) U11.2(AO1)
A2_L: U9.5(AO2) U9.6(AO2)
A2_R: U11.5(AO2) U11.6(AO2)
B1_L: U9.11(BO1) U9.12(BO1)
B1_R: U11.11(BO1) U11.12(BO1)
B2_L: U9.7(BO2) U9.8(BO2)
B2_R: U11.7(BO2) U11.8(BO2)
BOOT0: R57.1 R59.2 U3.60(BOOT0)
BOOT1: R58.1 R60.2 U3.28(PB2)
D0_LCD_DC: CN1.2 H7.22
D1_LCD_RST: CN1.1 H7.38
D5_LCD_SCK: CN1.4 H7.24
D7_LCD_DIN: CN1.5 H7.20
D8_LCD_CS: CN1.3 H7.23
FR_BST: C13.1 U5.7(BST)
FR_FB: R8.1 R9.2 U5.2(FB)
FR_PG: LED1.2(A) R10.2 U5.3(PG)
GPIO29_KEY: C7.2 D1.1 H7.39 R22.1 SW9.2
OS_8M_IN: C52.2 U3.5(PD0-OSC_IN) X2.3
OS_8M_OUT: C53.2 U3.6(PD1-OSC_OUT) X2.1
PA0_IN0: CN5.3 U3.14(PA0-WKUP)
PA1_BACKUP4: H25.3 U3.15(PA1)
PA2_UART2_TX: H7.34 U3.16(PA2)
PA3_UART2_RX: H7.31 U3.17(PA3)
PA4_INPUT16: CN5.4 U3.20(PA4)
PA5_INPUT17: H24.6 U3.21(PA5)
PA6_INPUT18: H24.7 U3.22(PA6)
PA7_INPUT10: H27.3 U3.23(PA7)
PA8_AIN2_R: U3.41(PA8) U11.22(AIN2)
PA9_AIN1_R: U3.42(PA9) U11.21(AIN1)
PA10_BIN1_R: U3.43(PA10) U11.17(BIN1)
PA11_BIN2_R: U3.44(PA11) U11.16(BIN2)
PA12_IN1: CN7.3 U3.45(PA12)
PA15_IN2: CN6.3 U3.50(PA15)
PB0_INPUT14: H27.6 U3.26(PB0)
PB1_INPUT15: H27.7 U3.27(PB1)
PB3_AIN2_L: U3.55(PB3) U9.22(AIN2)
PB4_BIN1_L: U3.56(PB4) U9.17(BIN1)
PB5_AIN1_L: U3.57(PB5)
PB5_BIN2_L: U9.16(BIN2)
PB6_PMMA_R: U3.58(PB6) U11.23(PWMA)
PB7_PMMB_R: U3.59(PB7) U11.15(PWMB)
PB8_PMMA_L: U3.61(PB8) U9.23(PWMA)
PB9_PMMB_L: U3.62(PB9) U9.15(PWMB)
PB10_SCL: R11.1 U3.29(PB10) U10.23(SCL)
PB11_SDA: R23.1 U3.30(PB11) U10.24(SDA)
PB12_BACKUP0: CN7.4 U3.33(PB12)
PB13_BACKUP1: H26.7 U3.34(PB13)
PB14_BACKUP2: H26.6 U3.35(PB14)
PB15_BACKUP3: H26.5 U3.36(PB15)
PC0_INPUT0: H25.7 U3.8(PC0)
PC1_INPUT1: H25.6 U3.9(PC1)
PC2_INPUT2: H25.5 U3.10(PC2)
PC3_INPUT3: H25.4 U3.11(PC3)
PC4_INPUT4: H27.4 U3.24(PC4)
PC5_INPUT5: H27.5 U3.25(PC5)
PC6_INPUT6: H26.4 U3.37(PC6)
PC7_INPUT7: H26.3 U3.38(PC7)
PC8_INPUT8: CN4.4 U3.39(PC8)
PC9_INPUT9: CN6.4 U3.40(PC9)
PC12_AIN1_L: U3.53(PC12) U9.21(AIN1)
PC13_INPUT11: H24.5 U3.2(PC13-TAMPER-RTC)
PC14_INPUT12: H24.4 U3.3(PC14-OSC32_IN)
PC15_INPUT13: H24.3 U3.4(PC15-OSC32_OUT)
PD2_IN3: CN4.3 U3.54(PD2)
RESET: C51.1 R52.2 SW12.3 SW12.4 U3.7(NRST)
RPI_GPIO1_BACKUP0: H7.11 H30.1
RPI_GPIO4_BACKUP1: H7.15 H30.2
RPI_GPIO5_BACKUP2: H7.17 H30.3
RPI_GPIO6_BACKUP3: H7.21 H30.4
RPI_RX: H7.30 UART1.3
RPI_TX: H7.8 UART1.4
RX0: CN3.1 H7.9
SWCLK: H29.3 U3.49(PA14)
SWDIO: H29.2 U3.46(PA13)
SY_BS: C20.1 U6.6(BS)
SY_FB: R14.2 R15.2 R16.1 U6.4(FB)
SY_PG: LED2.2(A) R13.2 U6.2(PG)
TX0: CN3.2 H7.7
UART3_RX: CN8.3 U3.52(PC11)
UART3_TX: CN8.4 U3.51(PC10)
$2N1181: R7.2 U5.1(SHDN#)
$2N1291: C9.2 U5.4(SS)
$2N2089: C13.2 L1.1 U5.6(LX)
$2N15773: SW10.3 U6.1(EN)
$2N17034: C20.2 L2.2 U6.10(LX)
$2N17130: C21.2 R14.1
$2N18130: LED4.2(A) R24.2
$2N20270: R7.1 SW11.3
$4N577: C29.2 C30.2 CN1.7 L4.2
$4N3144: H7.1 H28.2
$5N1404: C32.1 U10.10(REGOUT)
$5N1517: C33.1 U10.20(CPOUT)

Not connected (* = marked no-connect by the designer): CN1 8* 9*; CN2 3* 4*; CN4 5* 6*; CN5 5* 6*; CN6 5* 6*; CN7 5* 6*; CN8 1*; H7 2* 3* 4* 6* 10* 12* 13* 14* 16* 18* 19* 25* 26* 27* 28* 29* 32* 33* 35* 36* 37* 40*; SW9 3* 4*; SW10 1* EH*; SW11 1* EH*; U10 2(NC)* 3(NC)* 4(NC)* 5(NC)* 6(AUX_DA)* 7(AUX_CL)* 9(AD0)* 12(INT)* 14(NC)* 15(NC)* 16(NC)* 17(NC)* 19(RESV)* 21(RESV)* 22(RESV)*

## Notes on the sheets
sheet 1
- 电源输入
- 高阻态PG输出
- 电源指示灯
- 9V供电
- 5V降压模块
- 5V供电
- 3.3V供电
- 拧上去的输出
- 高阻态PG输出
- 用E12系列，选择120KΩ和8.2KΩ。比值是约14.63，误差在5%以内。
  E24系列，选择140KΩ和10KΩ。比值是14，完全符合
- 离地近的是R2
- Vout=0.6*(1+R1/R2)
- 12转9带3.3LDO输出
- 开关到空的行不行的
sheet 2
- 树莓派拓展引脚
- 屏幕排线
- 按键
- 激光雷达排线
- GPIO备用
- 蓝牙模块
sheet 3
- TB6612电机驱动
- TB6612电机驱动2
- 灰度输入（前）
- 灰度输入（左）
- 6050姿态传感器
- 灰度输入（右）
- 灰度输入（后）
- 四个编码器输入 位置就是轮子位置
